# Altium schematic sheet Shift register.SchDoc
size 297 x 209 mm
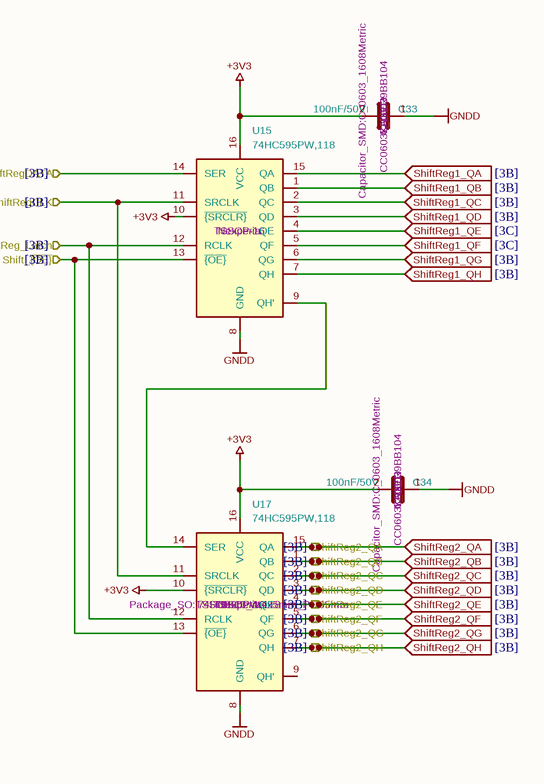
[diagram p0: Shift register.SchDoc]

## Parts
C33  MP: CC0603KRX7R9BB104  MF: YAGEO  Package: C_0603  Footprint: Capacitor_SMD:C_0603_1608Metric  [C_0603_1608Metric]  (hidden comment: 100nF/50V)
C34  MP: CC0603KRX7R9BB104  MF: YAGEO  Package: C_0603  Footprint: Capacitor_SMD:C_0603_1608Metric  [C_0603_1608Metric]  (hidden comment: 100nF/50V)
U15  MF: Nexperia  Package: TSSOP-16  [TSSOP-16_4.4x5mm_P0.65mm]  (hidden comment: 74HC595PW,118)
U17  MF: Nexperia  Package: TSSOP-16  Footprint: Package_SO:TSSOP-16_4.4x5mm_P0.65mm  [TSSOP-16_4.4x5mm_P0.65mm]  (hidden comment: 74HC595PW,118)

## Ports
Shift_~{{OE}} (in, see [3B]), ShiftReg1_QA (in, see [3B]), ShiftReg1_QB (in, see [3B]), ShiftReg1_QC (in, see [3B]), ShiftReg1_QD (in, see [3B]), ShiftReg1_QE (in, see [3C]), ShiftReg1_QF (in, see [3C]), ShiftReg1_QG (in, see [3B]), ShiftReg1_QH (in, see [3B]), ShiftReg2_QA (in, see [3B]), ShiftReg2_QB (in, see [3B]), ShiftReg2_QC (in, see [3B]), ShiftReg2_QD (in, see [3B]), ShiftReg2_QE (in, see [3B]), ShiftReg2_QF (in, see [3B]), ShiftReg2_QG (in, see [3B]), ShiftReg2_QH (in, see [3B]), ShiftReg_Latch (in, see [3B]), ShiftRegCLK (in, see [3B]), ShiftRegDATA (in, see [3B])

## Nets
+3V3: C33.2 C34.2 U15.10(~{{SRCLR}}) U15.16(VCC) U17.10(~{{SRCLR}}) U17.16(VCC)
GNDD: C33.1 C34.1 U15.8(GND) U17.8(GND)
Shift_~{{OE}}: U15.13(~{{OE}}) U17.13(~{{OE}}) ; port Shift_~{{OE}}
ShiftReg1_QA: U15.15(QA) ; port ShiftReg1_QA
ShiftReg1_QB: U15.1(QB) ; port ShiftReg1_QB
ShiftReg1_QC: U15.2(QC) ; port ShiftReg1_QC
ShiftReg1_QD: U15.3(QD) ; port ShiftReg1_QD
ShiftReg1_QE: U15.4(QE) ; port ShiftReg1_QE
ShiftReg1_QF: U15.5(QF) ; port ShiftReg1_QF
ShiftReg1_QG: U15.6(QG) ; port ShiftReg1_QG
ShiftReg1_QH: U15.7(QH) ; port ShiftReg1_QH
ShiftReg2_QA: U17.15(QA) ; port ShiftReg2_QA
ShiftReg2_QB: U17.1(QB) ; port ShiftReg2_QB
ShiftReg2_QC: U17.2(QC) ; port ShiftReg2_QC
ShiftReg2_QD: U17.3(QD) ; port ShiftReg2_QD
ShiftReg2_QE: U17.4(QE) ; port ShiftReg2_QE
ShiftReg2_QF: U17.5(QF) ; port ShiftReg2_QF
ShiftReg2_QG: U17.6(QG) ; port ShiftReg2_QG
ShiftReg2_QH: U17.7(QH) ; port ShiftReg2_QH
ShiftReg_Latch: U15.12(RCLK) U17.12(RCLK) ; port ShiftReg_Latch
ShiftRegCLK: U15.11(SRCLK) U17.11(SRCLK) ; port ShiftRegCLK
ShiftRegDATA: U15.14(SER) ; port ShiftRegDATA
NetU15_9: U15.9(QH') U17.14(SER)

Not connected (* = marked no-connect by the designer): U17 9(QH')

## Notes on the sheet
- 1
- 2
- 3
- 4
- 5
- 6
- A
- B
- C
- D
- Title:
- File: Shift register.kicad_sch
- Sheet: /
- KiCad E.D.A.  kicad (5.1.4)-1
- Size: A4
- Date:
- Rev:
- Id: 1/1

## Library data of the parts
C33 C34 = C: Value: 100nF/50V
U15 U17 = 74HC595: MP: 74HC595PW,118; Value: 74HC595PW,118
  U15: Footprint: Package_SO:TSSOP-16_4.4x5mm_P0.65mm